# EAGLE design simple-loop-active2 (EAGLE 6.6.0)

## Sheet 1 of 2
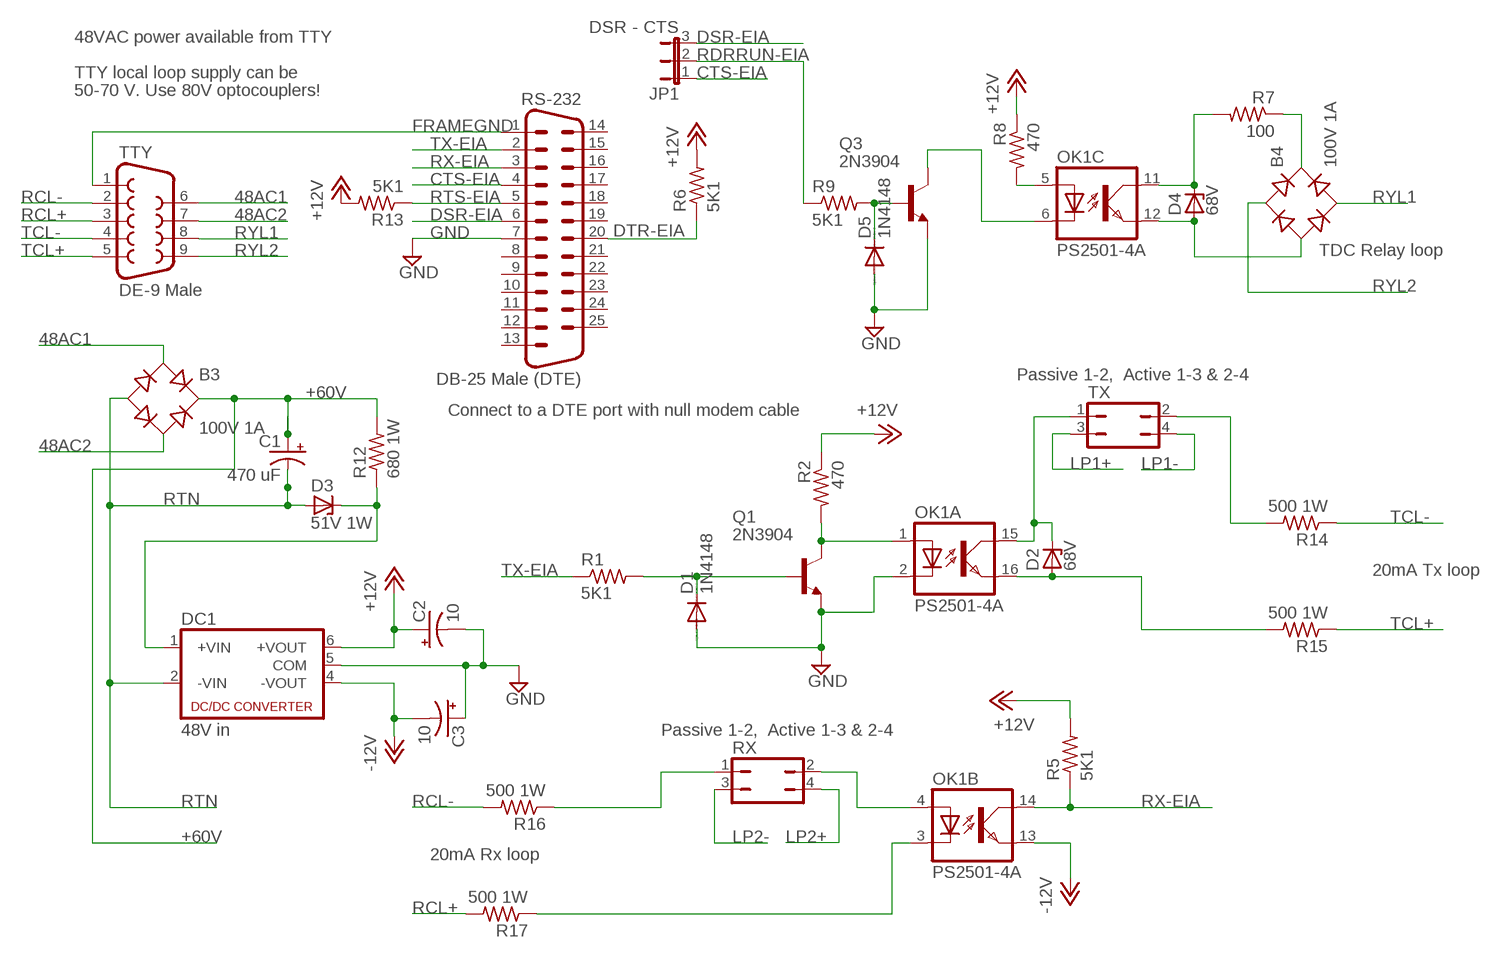
[diagram p0: schematic, sheet 1]

### Parts
B3  100V 1A  RB1A  [RB1A]
B4  100V 1A  RB1A  [RB1A]
C1  470 uF  CPOL-USE7.5-18  [E7,5-18]
C2  10  CPOL-USB45181A  [B45181A]
C3  10  CPOL-USB45181A  [B45181A]
D1  1N4148  1N4148DO35-10  [DO35-10]
D2  68V  ZENER-DIODEDO41Z10  [DO41Z10]
D3  51V 1W  ZENER-DIODEDO41Z10  [DO41Z10]
D4  68V  ZENER-DIODEDO41Z10  [DO41Z10]
D5  1N4148  1N4148DO35-10  [DO35-10]
DC1  48V in  NMA  [NMA]
JP1  DSR - CTS  JP2E  [JP2]
OK1  PS2501-4A  ILQ1  [DIL16]
Q1  2N3904  [TO92]
Q3  2N3904  [TO92]
R1  5K1  R-US_0207/10  [0207/10]
R2  470  R-US_0207/10  [0207/10]
R5  5K1  R-US_0207/10  [0207/10]
R6  5K1  R-US_0207/10  [0207/10]
R7  100  R-US_0207/10  [0207/10]
R8  470  R-US_0207/10  [0207/10]
R9  5K1  R-US_0207/10  [0207/10]
R12  680 1W  R-US_0817/7V  [P0817V]
R13  5K1  R-US_0207/10  [0207/10]
R14  500 1W  R-US_0817/7V  [P0817V]
R15  500 1W  R-US_0817/7V  [P0817V]
R16  500 1W  R-US_0817/7V  [P0817V]
R17  500 1W  R-US_0817/7V  [P0817V]
RS-232  DB-25 Male (DTE)  M25H  [M25H]
RX  JP2Q  [JP2Q]
TTY  DE-9 Male  F09H  [F09H]
TX  JP2Q  [JP2Q]

### Nets
48AC1: B3.AC1 TTY.6
48AC2: B3.AC2 TTY.7
+12V: C2.+ DC1.6(+VOUT) R2.1 R5.2 R6.2 R8.1 R13.2
+48VDC: D3.C DC1.1(+VIN) R12.1
+60V: B3.+ C1.+ R12.2 ; also sheet 2
-12V: C3.- DC1.4(-VOUT) OK1.13(B:EMIT)
CTS-EIA: JP1.1 RS-232.4
DSR-EIA: JP1.3 RS-232.6
DTR-EIA: R6.1 RS-232.20
FRAMEGND: RS-232.1 TTY.1
GND [GND]: C2.- C3.+ D1.A D5.A DC1.5(COM) OK1.2(A:C) Q1.3(E) Q3.3(E) RS-232.7
LP1+: TX.3 ; also sheet 2
LP1-: TX.4 ; also sheet 2
LP2+: RX.4 ; also sheet 2
LP2-: RX.3 ; also sheet 2
N$1: OK1.4(B:A) RX.2
N$2: R16.1 RX.1
N$3: OK1.3(B:C) R17.1
N$4: D2.A OK1.16(A:EMIT) R15.2
N$5: OK1.5(C:A) R8.2
N$6: D2.C OK1.15(A:COL) TX.1
N$7: D1.C Q1.2(B) R1.2
N$9: OK1.1(A:A) Q1.1(C) R2.2
N$11: D4.C OK1.11(C:COL) R7.2
N$12: B4.- D4.A OK1.12(C:EMIT)
N$13: B4.+ R7.1
N$15: OK1.6(C:C) Q3.1(C)
N$16: D5.C Q3.2(B) R9.2
N$19: R14.2 TX.2
RCL+: R17.2 TTY.3
RCL-: R16.2 TTY.2
RDRRUN-EIA: JP1.2 R9.1
RTN: B3.- C1.- D3.A DC1.2(-VIN) ; also sheet 2
RTS-EIA: R13.1 RS-232.5
RX-EIA: OK1.14(B:COL) R5.1 RS-232.3
RYL1: B4.AC2 TTY.8
RYL2: B4.AC1 TTY.9
TCL+: R15.1 TTY.5
TCL-: R14.1 TTY.4
TX-EIA: R1.1 RS-232.2
Unconnected: RS-232.8 RS-232.9 RS-232.10 RS-232.11 RS-232.12 RS-232.13 RS-232.14 RS-232.15 RS-232.16 RS-232.17 RS-232.18 RS-232.19 RS-232.21 RS-232.22 RS-232.23 RS-232.24 RS-232.25

### Notes on the sheet
- 48VAC power available from TTY
- TTY local loop supply can be
- 50-70 V. Use 80V optocouplers!
- TDC Relay loop
- Passive 1-2,  Active 1-3 & 2-4
- Connect to a DTE port with null modem cable
- 20mA Tx loop
- Passive 1-2,  Active 1-3 & 2-4
- 20mA Rx loop

## Sheet 2 of 2
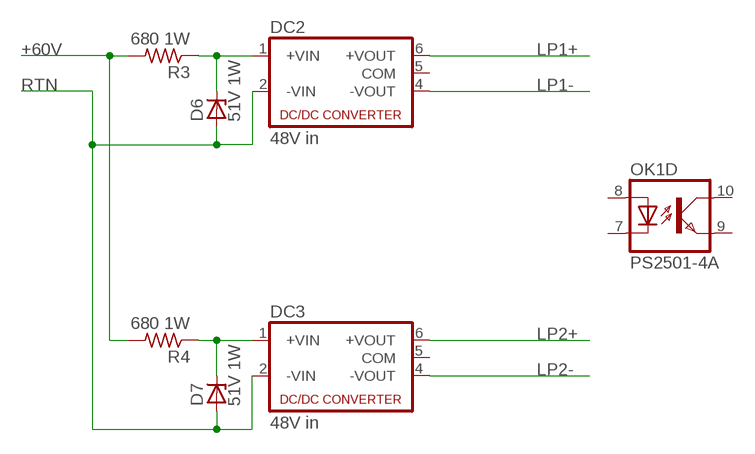
[diagram p1: schematic, sheet 2]

### Parts
D6  51V 1W  ZENER-DIODEDO41Z10  [DO41Z10]
D7  51V 1W  ZENER-DIODEDO41Z10  [DO41Z10]
DC2  48V in  NMA  [NMA]
DC3  48V in  NMA  [NMA]
R3  680 1W  R-US_0817/7V  [P0817V]
R4  680 1W  R-US_0817/7V  [P0817V]

### Nets
+48VDC1: D6.C DC2.1(+VIN) R3.1
+48VDC2: D7.C DC3.1(+VIN) R4.1
+60V: R3.2 R4.2 ; also sheet 1
LP1+: DC2.6(+VOUT) ; also sheet 1
LP1-: DC2.4(-VOUT) ; also sheet 1
LP2+: DC3.6(+VOUT) ; also sheet 1
LP2-: DC3.4(-VOUT) ; also sheet 1
RTN: D6.A D7.A DC2.2(-VIN) DC3.2(-VIN) ; also sheet 1
Unconnected: DC2.5(COM) DC3.5(COM) OK1.7(D:C) OK1.8(D:A) OK1.9(D:EMIT) OK1.10(D:COL)

## Library data of the parts
B3 B4 = rectifier:RB1A: RECTIFIER 1 A
C1-C3 = rcl:CPOL-US: POLARIZED CAPACITOR, American symbol
D1 D5 = diode:1N4148: DIODE high speed (Philips)
D2-D4 D6 D7 = diode:ZENER-DIODE: Z-Diode
DC1-DC3 = dc-dc-converter:NMA: DC-DC CONVERTER; MF: C & D TECHNOLOGIES, INC; MPN: NMA0515SC; OC_FARNELL: 1021434; OC_NEWARK: 61K3064
JP1 = jumper:JP2E: JUMPER
OK1 = optocoupler:ILQ1: SIEMENS OPTO COUPLER; MF: VISHAY/TELEFUNKEN; MPN: ILQ1; OC_FARNELL: 1469501; OC_NEWARK: 88K1954
Q1 Q3 = transistor-npn:2N3904: NPN Transistor
R1-R9 R12-R17 = rcl:R-US_: RESISTOR, American symbol
RS-232 = con-subd:M25: SUB-D; OC_FARNELL: unknown; OC_NEWARK: unknown
RX TX = dec-con:JP2Q: JUMPER
TTY = con-subd:F09: SUB-D; OC_FARNELL: unknown; OC_NEWARK: unknown

## Net classes
1 GND: width 0.508 mm

## Board
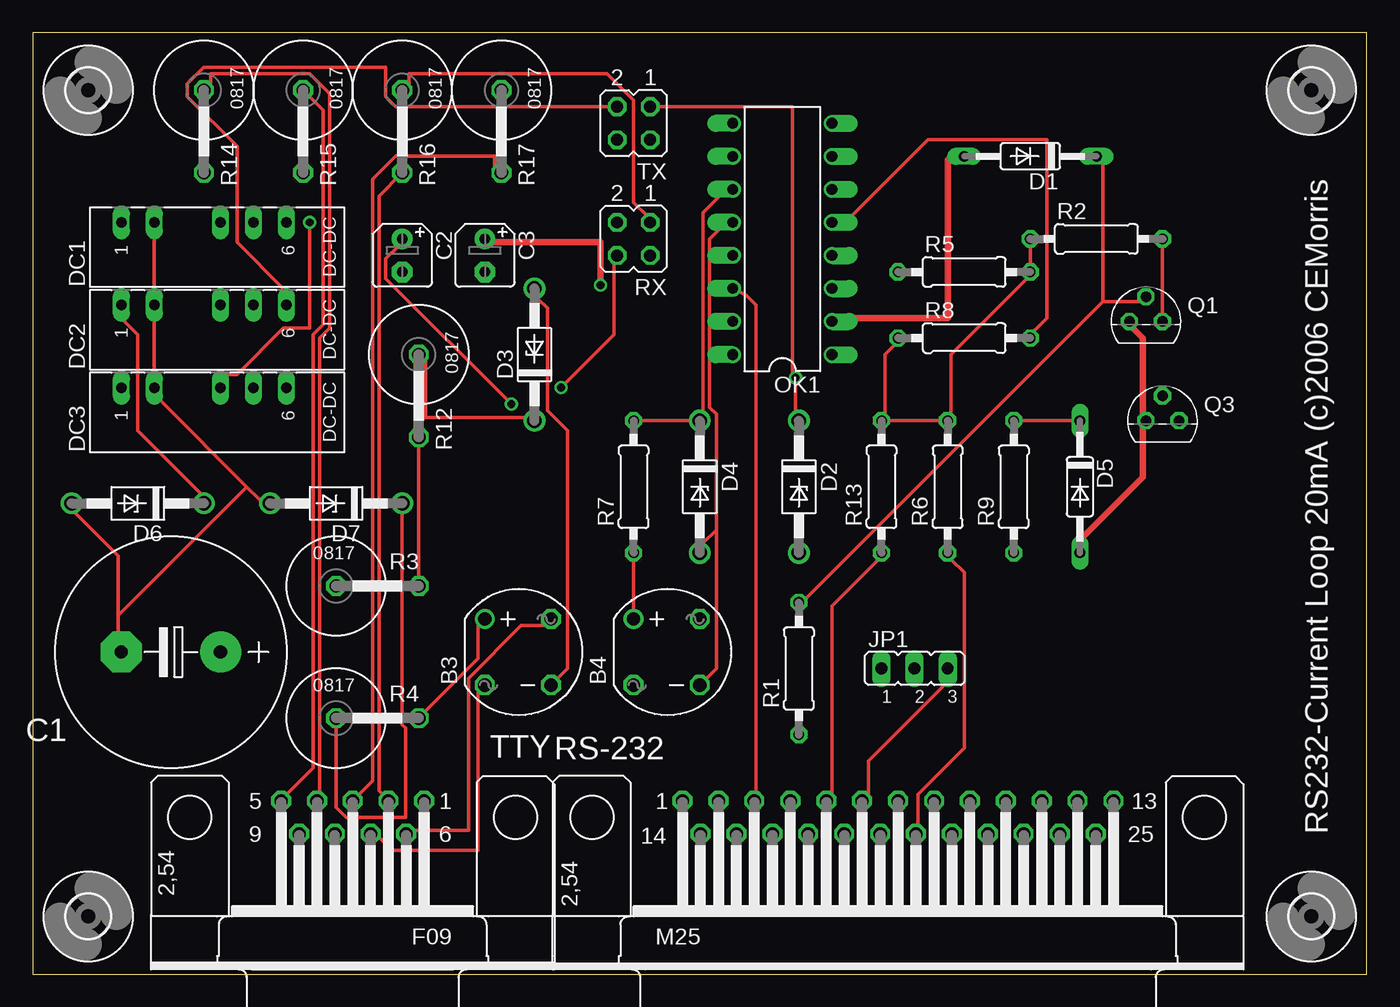
[diagram p2: board, top side]
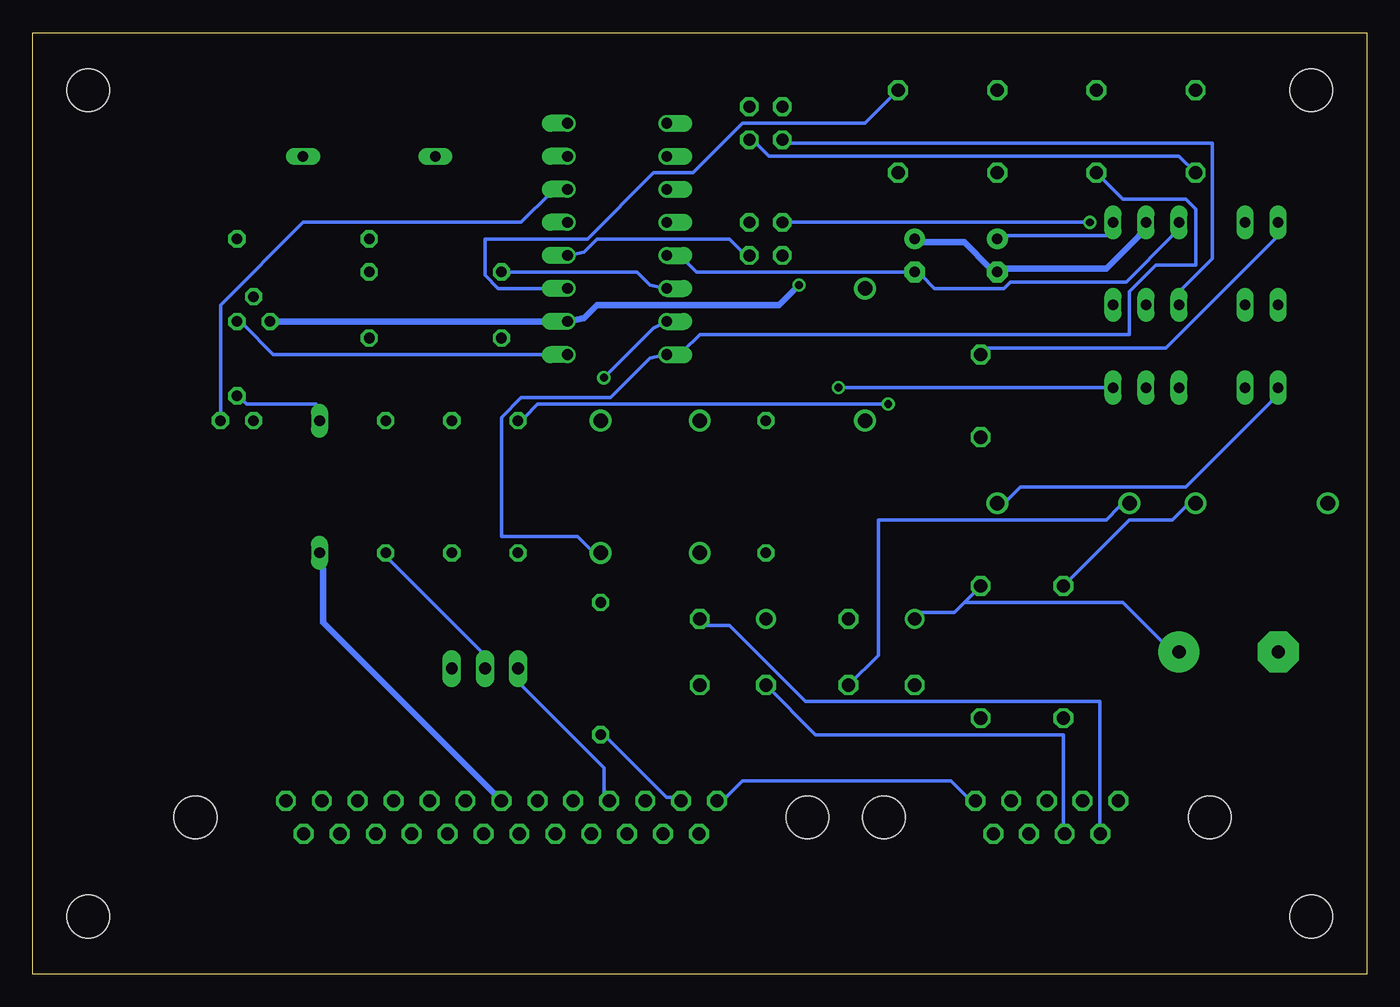
[diagram p3: board, bottom side, seen from below]

Size 102.54 x 72.37 mm. Coordinates in mm from the lower left corner, seen from the top.
Outline: 102.54,0 102.54,72.37 0,72.37 0,0 102.54,0
Copper layers (1*16): Top 0.035mm / dielectric 1.5mm / Bottom 0.035mm
Design rules "10mils *": minimum track width 10mil, minimum drill 24mil, track to track 10mil, track to pad 10mil, pad to pad 10mil, via to via 10mil, smd to smd 10mil, copper to edge 40mil, drill to drill 10mil, minimum pad ring 10mil, minimum via ring 8mil, stop-mask expansion 0mil, vias tented up to drill 0mil, thermal gap 10mil

### Footprints (pad centres in the part's own frame; a part is rotated, then mirrored left to right if it is on the bottom)
RB1A = drill 1.016: + -2.54,2.54 | drill 1.016 octagon: - 2.54,-2.54; AC1 2.54,2.54; AC2 -2.54,-2.54
E7,5-18 = drill 1.016 pad 3.15: + -3.81,0 | drill 1.016 pad 3.15 octagon: - 3.81,0
B45181A = drill 0.813 pad 1.6: + -1.27,0 | drill 0.813 pad 1.6 octagon: - 1.27,0
DO35-10 = drill 0.813 long: A 5.08,0; C -5.08,0
DO41Z10 = drill 1.118: A 5.08,0; C -5.08,0
NMA = drill 0.813 long: 1 0,6.35; 2 0,3.81; 4 0,-1.27; 5 0,-3.81; 6 0,-6.35
JP2 = drill 0.914 long: 1 -2.54,0; 2 0,0; 3 2.54,0
DIL16 = drill 0.813 offset: 1 -8.89,-3.81; 2 -6.35,-3.81; 3 -3.81,-3.81; 4 -1.27,-3.81; 5 1.27,-3.81; 6 3.81,-3.81; 7 6.35,-3.81; 8 8.89,-3.81; 9 8.89,3.81; 10 6.35,3.81; 11 3.81,3.81; 12 1.27,3.81; 13 -1.27,3.81; 14 -3.81,3.81; 15 -6.35,3.81; 16 -8.89,3.81
TO92 = drill 0.813 octagon: 1 1.27,0; 2 0,1.905; 3 -1.27,0
0207/10 = drill 0.813 octagon: 1 -5.08,0; 2 5.08,0
P0817V = drill 1.016 octagon: 1 -5.08,0; 2 1.27,0
M25H = drill 1.016 octagon: 1 -16.561,1.27; 2 -13.792,1.27; 3 -11.049,1.27; 4 -8.28,1.27; 5 -5.512,1.27; 6 -2.769,1.27; 7 0,1.27; 8 2.769,1.27; 9 5.512,1.27; 10 8.28,1.27; 11 11.049,1.27; 12 13.792,1.27; 13 16.561,1.27; 14 -15.189,-1.27; 15 -12.421,-1.27; 16 -9.652,-1.27; 17 -6.909,-1.27; 18 -4.14,-1.27; 19 -1.372,-1.27; 20 1.372,-1.27; 21 4.14,-1.27; 22 6.909,-1.27; 23 9.652,-1.27; 24 12.421,-1.27; 25 15.189,-1.27 | hole 3.302: 23.52,0; -23.52,0
JP2Q = drill 0.914 octagon: 1 -1.27,-1.27; 2 -1.27,1.27; 3 1.27,-1.27; 4 1.27,1.27
F09H = drill 1.016 octagon: 1 -5.486,-1.27; 2 -2.743,-1.27; 3 0,-1.27; 4 2.743,-1.27; 5 5.486,-1.27; 6 -4.115,1.27; 7 -1.372,1.27; 8 1.372,1.27; 9 4.115,1.27 | hole 3.302: -12.522,0; 12.522,0
3,3 = hole 3.3: 0,0

### Placement (x,y rotation side)
B3  37.3,24.76 0 top
B4  48.73,24.76 0 top
C1  10.63,24.76 180 top
C2  28.41,55.24 270 top
C3  34.76,55.24 270 top
D1  76.67,62.86 180 top
D2  58.89,37.46 270 top
D3  38.57,47.62 90 top
D4  51.27,37.46 270 top
D5  80.48,37.46 270 top
D6  8.09,36.19 180 top
D7  23.33,36.19 180 top
DC1  13.17,57.78 90 top
DC2  13.17,51.43 90 top
DC3  13.17,45.08 90 top
JP1  67.78,23.49 0 top
OK1  57.62,56.51 90 top
Q1  85.56,50.16 0 top
Q3  86.83,42.54 0 top
R1  58.89,23.49 90 top
R2  81.75,56.51 0 top
R3  28.41,29.84 0 top
R4  28.41,19.68 0 top
R5  71.59,53.97 0 top
R6  70.32,37.46 90 top
R7  46.19,37.46 90 top
R8  71.59,48.89 0 top
R9  75.4,37.46 90 top
R12  29.68,42.54 270 top
R13  65.24,37.46 90 top
R14  13.17,62.86 270 top
R15  20.79,62.86 270 top
R16  28.41,62.86 270 top
R17  36.03,62.86 270 top
RS-232  66.51,12.06 0 top
RX  46.19,56.51 180 top
TTY  24.6,12.06 180 top
TX  46.19,65.4 180 top
U$1  [3,3]  4.28,67.94 0 top
U$2  [3,3]  4.28,4.44 0 top
U$3  [3,3]  98.26,67.94 0 top
U$4  [3,3]  98.26,4.44 0 top

### Tracks (layer width: path | path; a pad name or v marks a point on that pad's centre or on a via)
48AC1
  Top 0.254: TTY.6 29.43,11.04 33.49,11.04 33.49,22.73 37.55,26.79 39.33,26.79 B3.AC1
48AC2
  Top 0.254: TTY.7 26.63,10.54 27.65,9.52 34.25,9.52 34.25,21.71 B3.AC2
+12V  (via drill 0.61)
  Top 0.254: R2.1 R5.2 76.42,53.46 70.57,47.62 70.57,43.05 R6.2 R13.2 65.49,43.05 65.49,47.62 66.26,48.38 R8.1 | v36.79,43.81 27.14,53.46 27.14,54.99 28.16,56 C2.+
  Bottom 0.254: C2.+ 27.9,56.76 20.03,56.76 DC1.6 | v36.79,43.81 63.72,43.81 64.73,42.79 R13.2
+48VDC
  Top 0.254: D3.C 37.81,42.79 30.19,42.79 30.19,47.11 R12.1
  Bottom 0.254: DC1.1 7.07,56.51 15.46,48.13 29.17,48.13 R12.1
+48VDC1
  Top 0.254: DC2.1 7.07,50.16 8.09,49.14 8.09,41.78 12.92,36.95 D6.C
  Bottom 0.254: R3.1 18.25,34.92 14.95,34.92 13.93,35.94 D6.C
+48VDC2
  Top 0.254: R4.1 23.33,12.82 24.09,12.06 28.66,12.06 28.66,18.92 28.41,19.17 D7.C
  Bottom 0.254: DC3.1 7.33,44.06 13.93,37.46 26.63,37.46 27.65,36.44 D7.C
+60V
  Top 0.254: R4.2 34.25,24.25 34.25,26.79 B3.+ | R3.2 R12.2
  Bottom 0.254: 30.95,28.57 31.71,27.81 34.25,27.81 B3.+ | 30.95,28.57 R3.2 | 30.95,28.57 18.76,28.57 15.2,25.01 C1.+
-12V
  Bottom 0.254: OK1.13 52.54,54.99 51.52,53.97 C3.- 34.25,53.72 33.24,52.7 27.9,52.7 27.39,53.21 18.5,53.21 14.95,56.76 DC1.4
CTS-EIA
  Bottom 0.254: JP1.1 64.99,22.22 58.64,15.87 58.64,13.84 RS-232.4
DSR-EIA
  Top 0.254: JP1.3 70.07,22.22 64.22,16.38 64.22,13.84 RS-232.6
DTR-EIA
  Top 0.254: 70.07,31.87 R6.1 70.57,31.87 71.59,30.86 71.59,17.39 68.03,13.84 68.03,11.3 RS-232.20
FRAMEGND
  Bottom 0.254: TTY.1 30.7,13.58 31.97,14.85 47.97,14.85 49.24,13.58 RS-232.1
GND  (via drill 0.61)
  Top 0.508: D5.A 80.73,33.65 85.31,38.22 85.31,42.03 Q3.3 85.31,43.05 85.31,48.89 84.54,49.65 Q1.3 | OK1.2 62.7,50.41 70.32,50.41 70.32,62.61 D1.A | v43.65,52.95 43.65,56.26 35.27,56.26 C3.+
  Bottom 0.508: C3.+ 34.25,56.26 30.95,56.26 28.92,54.22 C2.- 27.9,54.22 20.03,54.22 17.49,56.76 DC1.5 | v43.65,52.95 45.17,51.43 59.14,51.43 60.16,50.41 OK1.2 Q1.3 | RS-232.7 80.23,27.05 80.23,31.11 D5.A
LP1+
  Top 0.254: DC2.6 19.27,52.7 15.71,56.26 15.71,63.62 11.9,67.43 11.9,68.45 13.17,69.72 27.14,69.72 27.14,67.43 27.9,66.67 TX.3
LP1-
  Bottom 0.254: DC2.4 14.19,52.7 11.9,54.99 11.9,63.88 44.41,63.88 TX.4
LP2+  (via drill 0.61)
  Top 0.254: v40.6,45.08 44.67,49.14 44.67,54.73 RX.4
  Bottom 0.254: DC3.6 v40.6,45.08
LP2-  (via drill 0.61)
  Top 0.254: v21.3,57.78 21.3,49.65 19.27,49.65 15.71,46.1 14.95,46.1 DC3.4
  Bottom 0.254: v21.3,57.78 RX.3
N$1
  Bottom 0.254: OK1.4 60.16,55.49 59.14,56.51 48.98,56.51 47.97,55.49 RX.2
N$2
  Top 0.254: RX.1 47.21,58.29 46.19,59.3 46.19,67.18 44.16,69.21 28.92,69.21 28.92,68.45 R16.1
N$3
  Bottom 0.254: OK1.3 66.76,52.7 67.78,53.72 67.78,56.51 59.91,56.51 54.83,61.59 51.78,61.59 47.97,65.4 38.57,65.4 R17.1
N$4
  Bottom 0.254: D2.A 59.65,32.63 60.67,33.65 66.51,33.65 66.51,42.79 64.99,44.32 58.13,44.32 55.08,47.37 OK1.16 52.54,47.87 51.27,49.14 18.25,49.14 18.25,52.45 16.22,54.48 13.17,54.48 13.17,58.8 13.93,59.56 18.76,59.56 R15.2
N$5
  Top 0.254: OK1.5 62.7,58.03 68.8,64.13 77.94,64.13 77.94,50.41 76.92,49.4 R8.2
N$6  (via drill 0.61)
  Top 0.254: D2.C 58.64,43.3 v58.64,45.84 58.38,46.1 58.38,66.67 TX.1
  Bottom 0.254: v58.64,45.84 54.83,49.65 OK1.15
N$7
  Top 0.254: 82.26,51.68 85.05,51.68 Q1.2 | 82.26,51.68 82.26,62.35 D1.C | 82.26,51.68 59.4,28.82 R1.2
N$9
  Top 0.254: Q1.1 R2.2
  Bottom 0.254: OK1.1 84.04,47.62 86.32,49.91 Q1.1
N$11
  Top 0.254: R7.2 D4.C 51.52,43.3 51.52,58.54 52.79,59.81 OK1.11
N$12
  Top 0.254: 52.54,34.16 52.54,43.05 52.03,43.56 52.03,56.51 52.79,57.27 OK1.12 | 52.54,34.16 51.52,33.14 D4.A | 52.54,34.16 52.54,23.49 B4.-
N$13
  Top 0.254: B4.+ R7.1
N$15
  Bottom 0.254: OK1.6 62.7,60.07 64.99,57.78 81.75,57.78 88.1,51.43 Q3.1
N$16
  Top 0.254: R9.2 D5.C
  Bottom 0.254: Q3.2 86.32,44.06 86.07,43.81 80.73,43.81 D5.C
N$19
  Bottom 0.254: TX.2 46.95,63.88 45.94,62.86 14.44,62.86 R14.2
RCL+
  Top 0.254: TTY.3 26.12,14.85 26.12,61.08 27.9,62.86 35.52,62.86 35.52,62.1 R17.2
RCL-
  Top 0.254: TTY.2 26.63,14.09 26.63,59.81 R16.2
RDRRUN-EIA
  Top 0.254: R9.1 75.15,31.87
  Bottom 0.254: R9.1 75.15,31.87 68.03,24.76 JP1.2
RTN
  Top 0.254: DC1.2 DC2.2 DC3.2 9.87,44.06 16.47,37.46 | D3.A 38.82,51.94 39.59,51.18 39.59,43.3 41.11,41.78 41.11,23.49 B3.- | 16.47,37.46 17.49,36.44 D7.A | 6.57,27.55 6.57,25.52 C1.- | 6.57,27.55 6.57,32.13 3.26,35.43 D6.A | 6.57,27.55 16.47,37.46
  Bottom 0.254: B3.- 37.55,24.51 37.55,34.92 20.03,34.92 19.01,35.94 D7.A
RTS-EIA
  Top 0.254: R13.1 64.99,31.87 61.43,28.32 61.43,13.84 RS-232.5
RX-EIA
  Top 0.254: OK1.14 54.83,52.19 55.59,51.43 55.59,13.84 RS-232.3
  Bottom 0.254: OK1.14 55.08,52.95 56.1,53.97 R5.1
RYL1
  Bottom 0.254: B4.AC2 42.38,18.41 23.33,18.41 23.33,11.3 TTY.8
RYL2
  Bottom 0.254: B4.AC1 50.76,26.79 48.98,26.79 43.14,20.95 20.54,20.95 20.54,11.3 TTY.9
TCL+
  Top 0.254: TTY.5 19.52,13.84 21.55,15.87 21.55,49.14 22.31,49.91 22.31,66.42 R15.1
TCL-
  Top 0.254: TTY.4 22.06,13.84 22.06,48.89 22.82,49.65 22.82,67.69 21.3,69.21 13.68,69.21 13.68,68.45 R14.1
TX-EIA
  Bottom 0.254: R1.1 58.38,18.16 53.81,13.58 53.3,13.58 RS-232.2

### Text on the board
tNames: RS232-Current Loop 20mA (c)2006 CEMorris